# EasyEDA schematic scheme_easy_eda.json
TITLE: Sheet_1; REV: 1.0; Date: 2022-06-03; Sheet: 1/1; Drawn By: malayaaa3; Company: Your Company
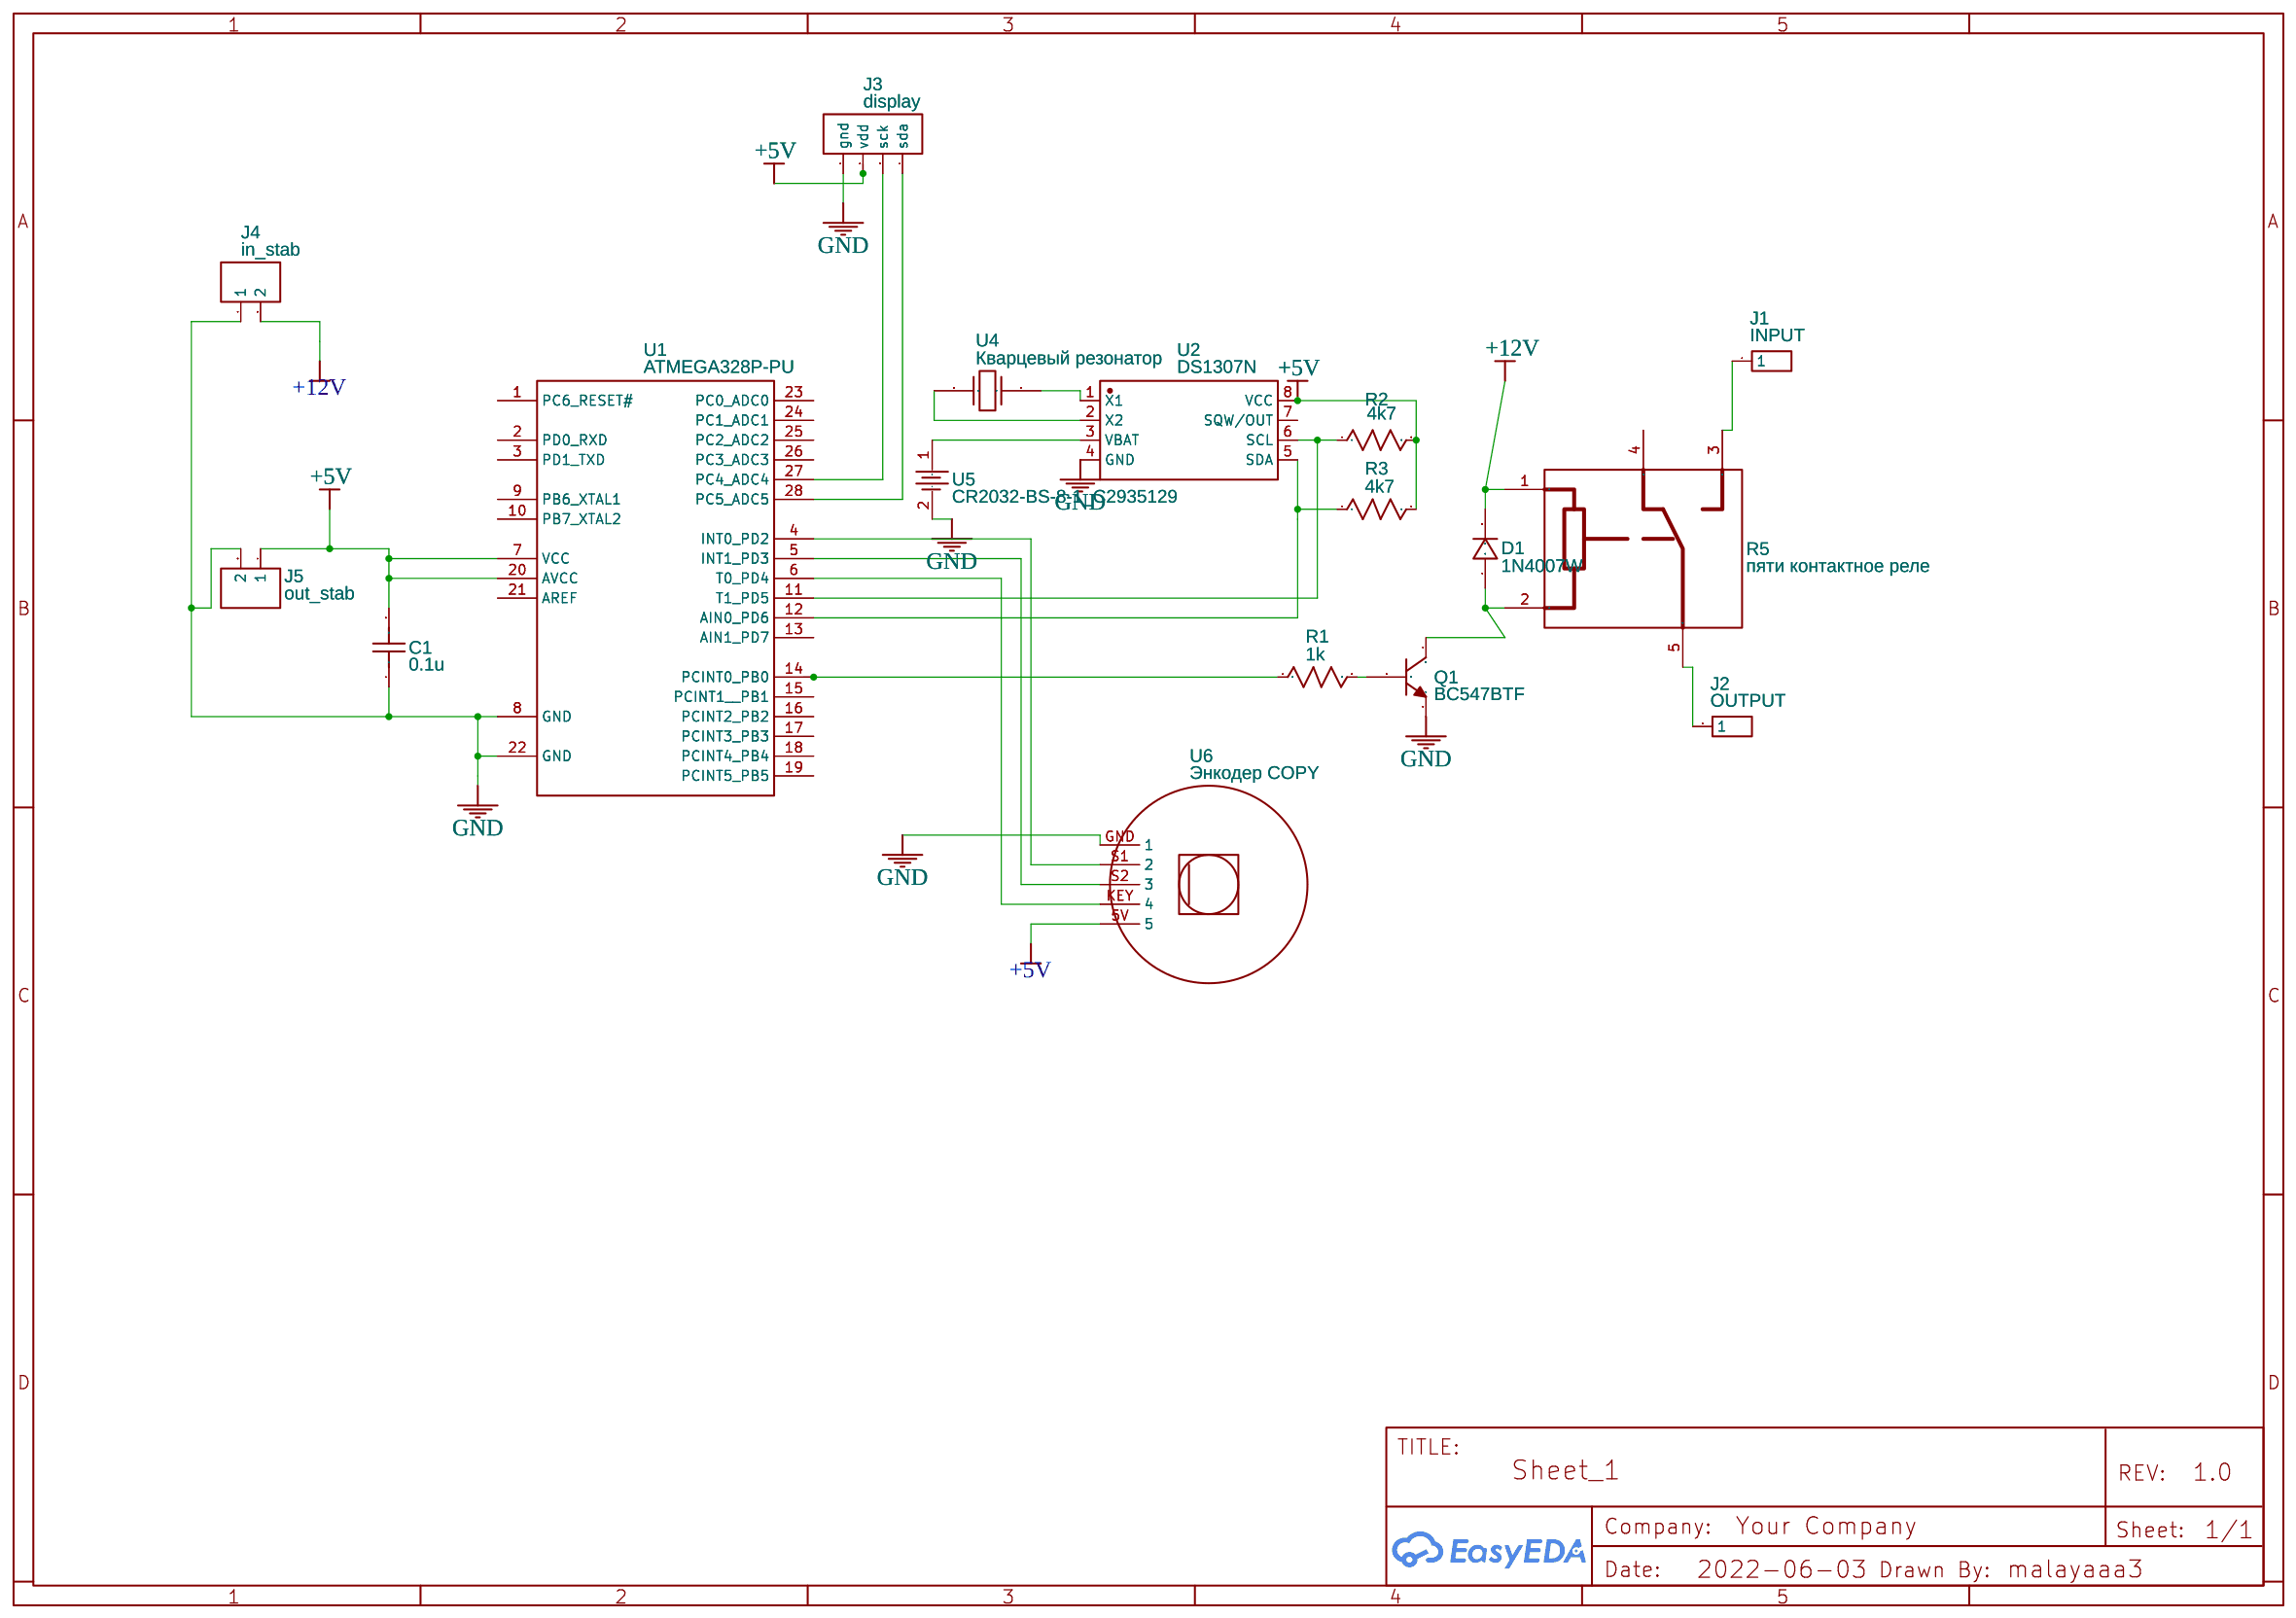
[diagram p0: schematic sheet]

## Parts
C1  0.1u  [100NF]
D1  1N4007W  [DIODE_DO41]
J1  INPUT  [HDR-M-2.54_1X1]
J2  OUTPUT  [HDR-M-2.54_1X1]
J3  display  [HDR-M-2.54_1X4]
J4  in_stab  [HDR-M-2.54_1X2]
J5  out_stab  [HDR-M-2.54_1X2]
Q1  BC547BTF  [TO-92-3_L4.9-W3.7-P2.54-L]
R1  1k  [C1-4_0.25В]
R2  4k7  [C1-4_0.25В]
R3  4k7  [C1-4_0.25В]
R5  пяти контактное реле  [ПЯТИКОНТАКТНОЕ РЕЛЕ]
U1  ATMEGA328P-PU  [DIP-28_L34.6-W7.3-P2.54-LS10.2-BL]
U2  DS1307N  [DIP-8_L9.8-W6.6-P2.54-LS7.6-BL]
U4  Кварцевый резонатор  [КВАРЦ]
U5  CR2032-BS-8-1_C2935129  [BAT-SMD_CR2032-BS-8-1]
U6  Энкодер COPY  [ЭНКОДЕР_ШЕЛКОГРАФТЯ]

## Library data of the parts
C1 = C_0603_US: Contributor: LCEDA_Lib
D1 = 1N4007W: Supplier: LCSC; Supplier Part: C328592; Manufacturer: BLUE ROCKET; Contributor: LCEDA_Lib; Package Display: No
J1 J2 = HDR-M-2.54_1x1: Supplier Part: C81276; Supplier: LCSC; Contributor: LCEDA_Lib
J3 = HDR-M-2.54_1x4: Supplier Part: C124378; Supplier: LCSC; Contributor: LCEDA_Lib
J4 J5 = HDR-M-2.54_1x2: Supplier Part: C124375; Supplier: LCSC; Contributor: LCEDA_Lib
Q1 = BC547BTF: Supplier: LCSC; Supplier Part: C900798; Manufacturer: ON(安森美); Contributor: LCSC; JLCPCB Part Class: Extended Part
R1-R3 = R_0603_US: Contributor: LCEDA_Lib
R5 = пяти контактное реле: Contributor: WTF O_o
U1 = ATMEGA328P-PU: sourceId: Oic6oiASL; Supplier: LCSC; Manufacturer: MICROCHIP; Contributor: LCSC; Supplier Part: C33901; JLCPCB Part Class: Extended Part
U2 = DS1307N: Supplier: LCSC; Supplier Part: C434596; Manufacturer: HGSEMI; Contributor: LCSC; JLCPCB Part Class: Extended Part
U4 = Кварцевый резонатор: Contributor: Metelkov
U5 = CR2032-BS-8-1_C2935129: Supplier: LCSC; Supplier Part: C2935129; Manufacturer: null; Manufacturer Part: CR2032-BS-8-1; Contributor: LCSC; JLCPCB Part Class: Extended Part
U6 = Энкодер COPY: Manufacturer Part: Энкодер; Contributor: alexmajor104

## Nets
+5V: C1.2 J3.2(vdd) J5.1 R2.2 R3.2 U1.7(VCC) U1.20(AVCC) U2.8(VCC) U6.5V(5)
+12V: D1.2(1) J4.2 R5.1(2)
GND: C1.1 J3.1(gnd) J4.1 J5.2 Q1.3(E) U1.8(GND) U1.22(GND) U2.4(GND) U5.2(-) U6.GND(1)
Net-(D1-1): D1.1(2) Q1.1(C) R5.2(1)
Net-(J1-1): J1.1 R5.3(4)
Net-(J2-1): J2.1 R5.5
Net-(J3-3): J3.3(sck) U1.27(PC4 ADC4)
Net-(J3-4): J3.4(sda) U1.28(PC5 ADC5)
Net-(Q1-2): Q1.2(B) R1.2
Net-(R1-1): R1.1 U1.14(PCINT0 PB0)
Net-(R2-1): R2.1 U1.11(T1 PD5) U2.6(SCL)
Net-(R3-1): R3.1 U1.12(AIN0 PD6) U2.5(SDA)
Net-(U1-4): U1.4(INT0 PD2) U6.S1(2)
Net-(U1-5): U1.5(INT1 PD3) U6.S2(3)
Net-(U1-6): U1.6(T0 PD4) U6.KEY(4)
Net-(U2-1): U2.1(X1) U4.1
Net-(U2-2): U2.2(X2) U4.2
Net-(U2-3): U2.3(VBAT) U5.1(+)

Not connected (* = marked no-connect by the designer): R5 4(3); U1 1(PC6 RESET#) 2(PD0 RXD) 3(PD1 TXD) 9(PB6 XTAL1) 10(PB7 XTAL2) 13(AIN1 PD7) 15(PCINT1  PB1) 16(PCINT2 PB2) 17(PCINT3 PB3) 18(PCINT4 PB4) 19(PCINT5 PB5) 21(AREF) 23(PC0 ADC0) 24(PC1 ADC1) 25(PC2 ADC2) 26(PC3 ADC3); U2 7(SQW/OUT)
